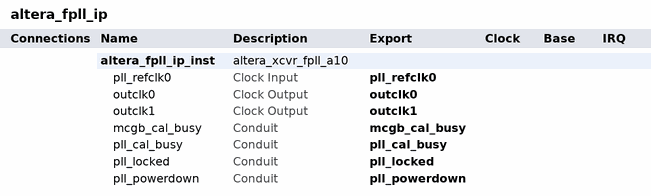
[diagram p0: system contents]
# Platform Designer (Qsys) system altera_fpll_ip, Arria 10 10AX115R3F40I2SGES
# Parameters at their usual value, and those the tool derives, are not listed.
package require -exact qsys 14.1
create_system altera_fpll_ip
set_project_property DEVICE_FAMILY {Arria 10}
set_project_property DEVICE 10AX115R3F40I2SGES

add_instance altera_fpll_ip_inst altera_xcvr_fpll_a10 14.1
set_instance_property altera_fpll_ip_inst AUTO_EXPORT true
set_instance_parameter_value altera_fpll_ip_inst rcfg_debug 0
set_instance_parameter_value altera_fpll_ip_inst enable_pll_reconfig 0
set_instance_parameter_value altera_fpll_ip_inst rcfg_jtag_enable 0
set_instance_parameter_value altera_fpll_ip_inst set_embedded_debug_enable 0
set_instance_parameter_value altera_fpll_ip_inst set_capability_reg_enable 0
set_instance_parameter_value altera_fpll_ip_inst set_user_identifier 0
set_instance_parameter_value altera_fpll_ip_inst set_csr_soft_logic_enable 0
set_instance_parameter_value altera_fpll_ip_inst rcfg_file_prefix altera_xcvr_fpll_vi
set_instance_parameter_value altera_fpll_ip_inst rcfg_sv_file_enable 0
set_instance_parameter_value altera_fpll_ip_inst rcfg_h_file_enable 0
set_instance_parameter_value altera_fpll_ip_inst rcfg_txt_file_enable 0
set_instance_parameter_value altera_fpll_ip_inst rcfg_mif_file_enable 0
set_instance_parameter_value altera_fpll_ip_inst rcfg_multi_enable 0
set_instance_parameter_value altera_fpll_ip_inst rcfg_profile_cnt 2
set_instance_parameter_value altera_fpll_ip_inst rcfg_profile_select 1
set_instance_parameter_value altera_fpll_ip_inst system_info_device_family {Arria 10}
set_instance_parameter_value altera_fpll_ip_inst gui_device_speed_grade fastest
set_instance_parameter_value altera_fpll_ip_inst gui_fpll_mode 0
set_instance_parameter_value altera_fpll_ip_inst gui_hssi_prot_mode 0
set_instance_parameter_value altera_fpll_ip_inst gui_refclk_switch false
set_instance_parameter_value altera_fpll_ip_inst gui_refclk1_frequency 100.0
set_instance_parameter_value altera_fpll_ip_inst gui_switchover_mode {Automatic Switchover}
set_instance_parameter_value altera_fpll_ip_inst gui_switchover_delay 0
set_instance_parameter_value altera_fpll_ip_inst gui_enable_active_clk false
set_instance_parameter_value altera_fpll_ip_inst gui_enable_clk_bad false
set_instance_parameter_value altera_fpll_ip_inst generate_docs 1
set_instance_parameter_value altera_fpll_ip_inst generate_add_hdl_instance_example 0
set_instance_parameter_value altera_fpll_ip_inst gui_bw_sel low
set_instance_parameter_value altera_fpll_ip_inst gui_self_reset_enabled false
set_instance_parameter_value altera_fpll_ip_inst silicon_rev false
set_instance_parameter_value altera_fpll_ip_inst gui_reference_clock_frequency 644.53125
set_instance_parameter_value altera_fpll_ip_inst gui_desired_refclk_frequency 100.0
set_instance_parameter_value altera_fpll_ip_inst gui_actual_refclk_frequency 100.0
set_instance_parameter_value altera_fpll_ip_inst gui_operation_mode 0
set_instance_parameter_value altera_fpll_ip_inst gui_iqtxrxclk_outclk_index 0
set_instance_parameter_value altera_fpll_ip_inst gui_refclk_cnt 1
set_instance_parameter_value altera_fpll_ip_inst gui_refclk_index 0
set_instance_parameter_value altera_fpll_ip_inst gui_enable_fractional false
set_instance_parameter_value altera_fpll_ip_inst gui_enable_pld_cal_busy_port 1
set_instance_parameter_value altera_fpll_ip_inst gui_enable_hip_cal_done_port 0
set_instance_parameter_value altera_fpll_ip_inst gui_hip_cal_en 0
set_instance_parameter_value altera_fpll_ip_inst gui_enable_cascade_out false
set_instance_parameter_value altera_fpll_ip_inst gui_cascade_outclk_index 0
set_instance_parameter_value altera_fpll_ip_inst gui_enable_dps false
set_instance_parameter_value altera_fpll_ip_inst gui_enable_manual_config false
set_instance_parameter_value altera_fpll_ip_inst gui_hssi_output_clock_frequency 1250.0
set_instance_parameter_value altera_fpll_ip_inst gui_pll_m_counter 1
set_instance_parameter_value altera_fpll_ip_inst gui_pll_n_counter 1
set_instance_parameter_value altera_fpll_ip_inst gui_fractional_x 32
set_instance_parameter_value altera_fpll_ip_inst gui_pll_dsm_fractional_division 1
set_instance_parameter_value altera_fpll_ip_inst gui_pll_c_counter_0 1
set_instance_parameter_value altera_fpll_ip_inst gui_pll_c_counter_1 1
set_instance_parameter_value altera_fpll_ip_inst gui_pll_c_counter_2 1
set_instance_parameter_value altera_fpll_ip_inst gui_pll_c_counter_3 1
set_instance_parameter_value altera_fpll_ip_inst gui_number_of_output_clocks 2
set_instance_parameter_value altera_fpll_ip_inst gui_desired_outclk0_frequency 156.25
set_instance_parameter_value altera_fpll_ip_inst gui_actual_outclk0_frequency {100.0 MHz}
set_instance_parameter_value altera_fpll_ip_inst gui_outclk0_phase_shift_unit 0
set_instance_parameter_value altera_fpll_ip_inst gui_outclk0_desired_phase_shift 0.0
set_instance_parameter_value altera_fpll_ip_inst gui_outclk0_actual_phase_shift {0 ps}
set_instance_parameter_value altera_fpll_ip_inst gui_outclk0_actual_phase_shift_deg 0.0
set_instance_parameter_value altera_fpll_ip_inst gui_desired_outclk1_frequency 312.5
set_instance_parameter_value altera_fpll_ip_inst gui_actual_outclk1_frequency {100.0 MHz}
set_instance_parameter_value altera_fpll_ip_inst gui_outclk1_phase_shift_unit 0
set_instance_parameter_value altera_fpll_ip_inst gui_outclk1_desired_phase_shift 0
set_instance_parameter_value altera_fpll_ip_inst gui_outclk1_actual_phase_shift {0 ps}
set_instance_parameter_value altera_fpll_ip_inst gui_outclk1_actual_phase_shift_deg 0.0
set_instance_parameter_value altera_fpll_ip_inst gui_desired_outclk2_frequency 100.0
set_instance_parameter_value altera_fpll_ip_inst gui_actual_outclk2_frequency {100.0 MHz}
set_instance_parameter_value altera_fpll_ip_inst gui_outclk2_phase_shift_unit 0
set_instance_parameter_value altera_fpll_ip_inst gui_outclk2_desired_phase_shift 0
set_instance_parameter_value altera_fpll_ip_inst gui_outclk2_actual_phase_shift {0 ps}
set_instance_parameter_value altera_fpll_ip_inst gui_outclk2_actual_phase_shift_deg {0 deg}
set_instance_parameter_value altera_fpll_ip_inst gui_desired_outclk3_frequency 100.0
set_instance_parameter_value altera_fpll_ip_inst gui_actual_outclk3_frequency {100.0 MHz}
set_instance_parameter_value altera_fpll_ip_inst gui_outclk3_phase_shift_unit 0
set_instance_parameter_value altera_fpll_ip_inst gui_outclk3_desired_phase_shift 0
set_instance_parameter_value altera_fpll_ip_inst gui_outclk3_actual_phase_shift {0 ps}
set_instance_parameter_value altera_fpll_ip_inst gui_outclk3_actual_phase_shift_deg 0.0
set_instance_parameter_value altera_fpll_ip_inst gui_desired_hssi_cascade_frequency 100.0
set_instance_parameter_value altera_fpll_ip_inst set_altera_xcvr_fpll_a10_calibration_en 0
set_instance_parameter_value altera_fpll_ip_inst enable_mcgb 0
set_instance_parameter_value altera_fpll_ip_inst mcgb_div 1
set_instance_parameter_value altera_fpll_ip_inst enable_hfreq_clk 0
set_instance_parameter_value altera_fpll_ip_inst enable_mcgb_pcie_clksw 0
set_instance_parameter_value altera_fpll_ip_inst mcgb_aux_clkin_cnt 0
set_instance_parameter_value altera_fpll_ip_inst enable_bonding_clks 0
set_instance_parameter_value altera_fpll_ip_inst enable_fb_comp_bonding 0
set_instance_parameter_value altera_fpll_ip_inst pma_width 64
set_instance_parameter_value altera_fpll_ip_inst enable_pld_mcgb_cal_busy_port 1

# exported interfaces
add_interface pll_refclk0 clock sink
set_interface_property pll_refclk0 EXPORT_OF altera_fpll_ip_inst.pll_refclk0
add_interface pll_powerdown conduit end
set_interface_property pll_powerdown EXPORT_OF altera_fpll_ip_inst.pll_powerdown
add_interface pll_locked conduit end
set_interface_property pll_locked EXPORT_OF altera_fpll_ip_inst.pll_locked
add_interface outclk0 clock source
set_interface_property outclk0 EXPORT_OF altera_fpll_ip_inst.outclk0
add_interface outclk1 clock source
set_interface_property outclk1 EXPORT_OF altera_fpll_ip_inst.outclk1
add_interface pll_cal_busy conduit end
set_interface_property pll_cal_busy EXPORT_OF altera_fpll_ip_inst.pll_cal_busy
add_interface mcgb_cal_busy conduit end
set_interface_property mcgb_cal_busy EXPORT_OF altera_fpll_ip_inst.mcgb_cal_busy

set_interconnect_requirement {$system} qsys_mm.clockCrossingAdapter HANDSHAKE
set_interconnect_requirement {$system} qsys_mm.maxAdditionalLatency 1
set_interconnect_requirement {$system} qsys_mm.insertDefaultSlave FALSE

save_system altera_fpll_ip.qsys
